# Altium project Encoder.PrjPcb
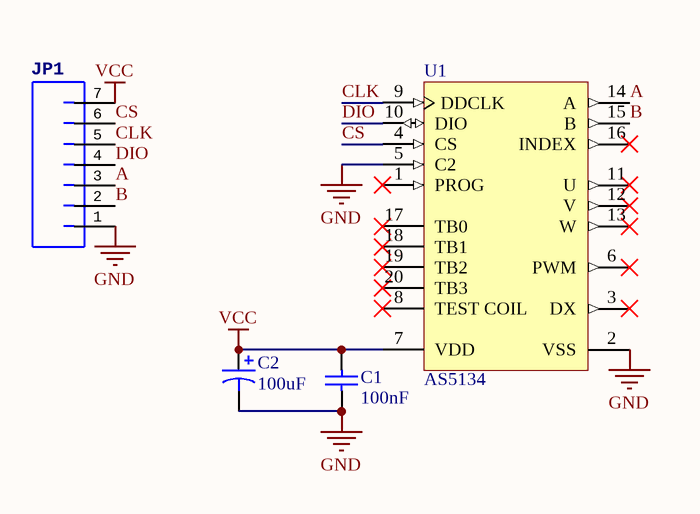
[diagram p0: Encoder.SchDoc]
1 sheet, 4 parts. Net scope: global (net labels, ports and power ports of the same name join across sheets).
Board file: Encoder.PcbDoc

## Sheet Encoder.SchDoc
size A

### Parts
C1  100nF  [CAPC0603(1608)100_M]
C2  100uF  [AVX-CAPC7343_V]
JP1  (no value)  [JST-7-PTH]
U1  AS5134  [AMS-SSOP-20-7200X5300DE_L]

### Nets
GND: C1.1 C2.2 JP1.1 U1.2(VSS) U1.5(C2)
VCC: C1.2 C2.1 JP1.7 U1.7(VDD)
A: JP1.3 U1.14(A)
B: JP1.2 U1.15(B)
CLK: JP1.5 U1.9(DDCLK)
CS: JP1.6 U1.4(CS)
DIO: JP1.4 U1.10(DIO)

Not connected (* = marked no-connect by the designer): U1 1(PROG)* 3(DX)* 6(PWM)* 8(TEST_COIL)* 11(U)* 12(V)* 13(W)* 16(INDEX)* 17(TB0)* 18(TB1)* 19(TB2)* 20(TB3)*

### Library data of the parts
C1 = CMP-1035-02575-1: CAP 100nF 6.3V Â±5% 0603 (1608 Metric) Thickness 1mm SMD; Case-Metric: 1608; Case-EIA: 0603; Tolerance: Â±5%; Technology: SMT; Rated Voltage: 6.3 V; Max Thickness: 1 mm; Value: 100nF
C2 = AVX-CAP-P-2
JP1 = JST_7_RIGHT
U1 = CMP-0555-00029-2: 360 Step Programmable High Speed Magnetic Rotary Encoder, 5 V, SSOP-20, Pb-Free, Reel; PartNumber: AS5134-ZSST; Manufacturer: AMS; Supply Voltage (V): 5; Automotive Qual.: YES; Resolution: 8.5 bit; Output: absolute serial SSI, PWM, incremental, BLDC motor commutation; ComponentLink1URL: www.ams.com; Mounting Technology: Surface Mount; ComponentLink2Description: Datasheet; DatasheetVersion: Rev. 2.3; PackageReference: SSOP-20; PackageDescription: 20-Pin Shrink Small Outline Package, 7.2 x 5.3 mm Body, 0.65 mm Pitch; PackageVersion: Rev. 2.3, 04/2012; Features: selectable pole pairs, high speed, multi-turn low power, zero position / sensitivity programming, etc.; ComponentLink1Description: Manufacturer URL; ComponentLink2URL: http://www.ams.com/eng/content/download/12300/217001/504